# EAGLE design Terrarium (EAGLE 9.6.2)
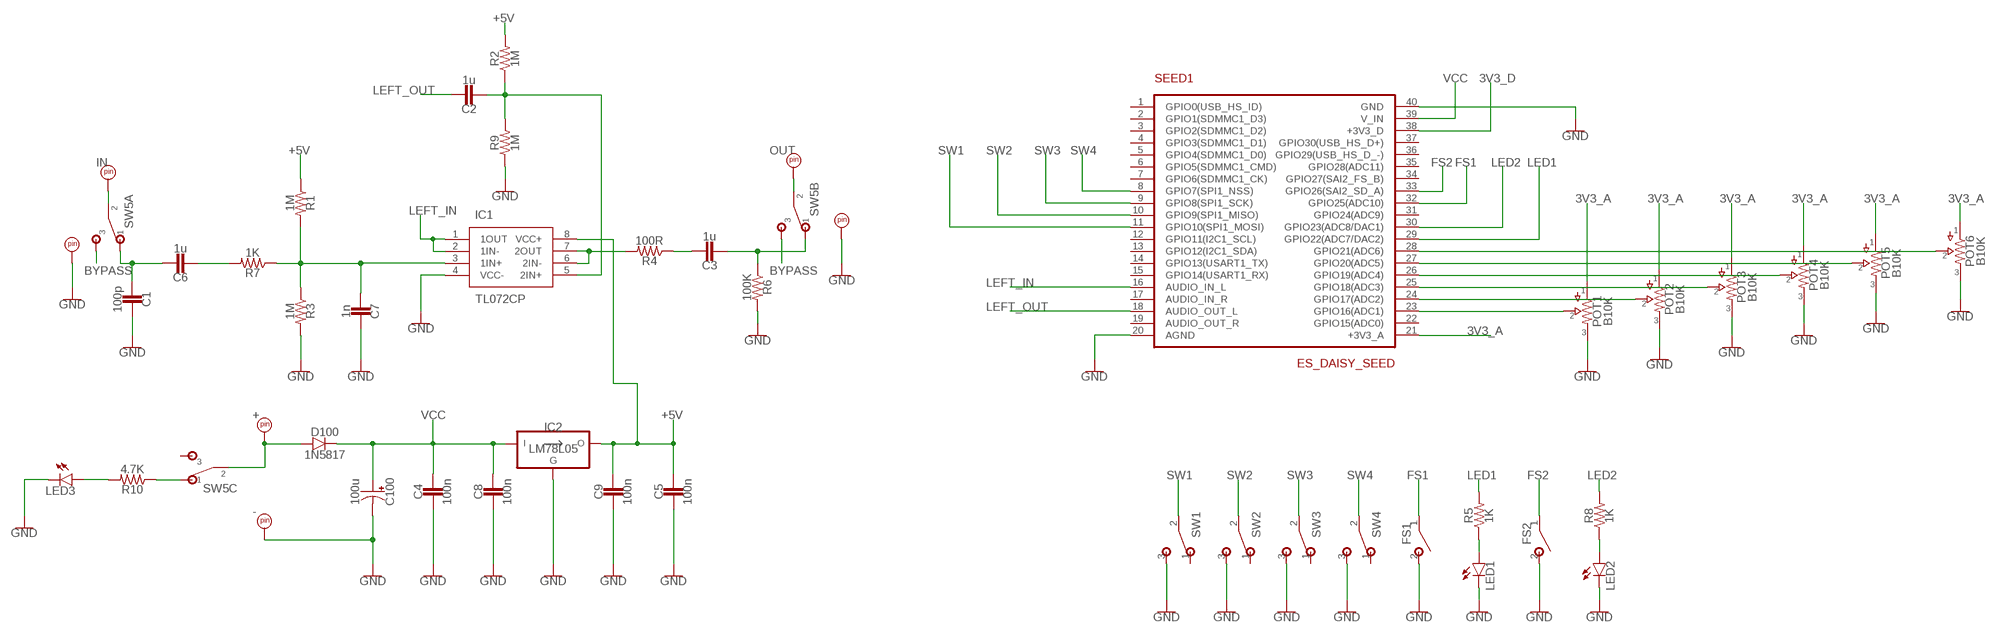
[diagram p0: schematic, sheet 1]

## Parts
C1  100p  CAP.2  [5MM]
C2  1u  CAP.5  [.33UF+]
C3  1u  CAP.5  [.33UF+]
C4  100n  CAP.2  [5MM]
C5  100n  CAP.2  [5MM]
C6  1u  CAP.5  [.33UF+]
C7  1n  CAP.2  [5MM]
C8  100n  CAP.2  [5MM]
C9  100n  CAP.2  [5MM]
C100  100u  5.0_MM.4  [050_2.5MM.2]
D100  1N5817  DO41.3  [DO41-3]
FS1  SPST  [SPST]
FS2  SPST  [SPST]
GND  PADRD  [UNLABELED]
IC1  TL072CP  [DIP794W53P254L959H508Q8N]
IC2  LM78L05  [TO92-]
IN  PADRD  [UNLABELED]
IN_GND  PADRD  [UNLABELED]
LED1  LED.3  [3MM_2]
LED2  LED.3  [3MM_2]
LED3  LED.3  [3MM_2]
OUT  PADRD  [UNLABELED]
OUT_GND  PADRD  [UNLABELED]
POT1  B10K  16MM.5  [16MM_PADS.2]
POT2  B10K  16MM.5  [16MM_PADS.2]
POT3  B10K  16MM.5  [16MM_PADS.2]
POT4  B10K  16MM.5  [16MM_PADS.2]
POT5  B10K  16MM.5  [16MM_PADS.2]
POT6  B10K  16MM.5  [16MM_PADS.2]
PWR  PADRD  [UNLABELED]
R1  1M  R.3B  [7.5MM.2]
R2  1M  R.3B  [7.5MM.2]
R3  1M  R.3B  [7.5MM.2]
R4  100R  R.3B  [7.5MM.2]
R5  1K  R.3B  [7.5MM.2]
R6  100K  R.3B  [7.5MM.2]
R7  1K  R.3B  [7.5MM.2]
R8  1K  R.3B  [7.5MM.2]
R9  1M  R.3B  [7.5MM.2]
R10  4.7K  R.3B  [7.5MM.2]
SEED1  ES_DAISY_SEED  [ES_DAISY_SEED]
SW1  SPDT.1  [SPDT_SOLDER_LUG]
SW2  SPDT.1  [SPDT_SOLDER_LUG]
SW3  SPDT.1  [SPDT_SOLDER_LUG]
SW4  SPDT.1  [SPDT_SOLDER_LUG]
SW5  3PDTTOGGLE  [3PDT2]

## Nets
3V3_A: POT1.1 POT2.1 POT3.1 POT4.1 POT5.1 POT6.1 SEED1.21(+3V3_A)
3V3_D: SEED1.38(+3V3_D)
+5V: C5.1 C9.1 IC1.8(VCC+) IC2.3(VO) R1.1 R2.2
BYPASS: SW5.A3 SW5.B3
FS1: FS1.1(P) SEED1.32(GPIO25(ADC10))
FS2: FS2.1(P) SEED1.33(GPIO26(SAI2_SD_A))
GND: C1.1 C4.2 C5.2 C7.1 C8.2 C9.2 C100.- FS1.2(S) FS2.2(S) GND.P$1 IC1.4(VCC-) IC2.2(GND) IN_GND.P$1 LED1.P$1(C) LED2.P$1(C) LED3.P$1(C) OUT_GND.P$1 POT1.3 POT2.3 POT3.3 POT4.3 POT5.3 POT6.3 R3.2 R6.2 R9.1 SEED1.20(AGND) SEED1.40(GND) SW1.3(S) SW2.3(S) SW3.3(S) SW4.3(S)
LED1: R5.2 SEED1.29(GPIO22(ADC7/DAC2))
LED2: R8.2 SEED1.30(GPIO23(ADC8/DAC1))
LEFT_IN: IC1.1(1OUT) IC1.2(1IN-) SEED1.16(AUDIO_IN_L)
LEFT_OUT: C2.1 SEED1.18(AUDIO_OUT_L)
N$1: POT1.2 SEED1.23(GPIO16(ADC1))
N$2: POT2.2 SEED1.24(GPIO17(ADC2))
N$3: POT3.2 SEED1.25(GPIO18(ADC3))
N$4: POT4.2 SEED1.26(GPIO19(ADC4))
N$5: POT5.2 SEED1.27(GPIO20(ADC5))
N$6: POT6.2 SEED1.28(GPIO21(ADC6))
N$7: LED1.ANODE(A) R5.1
N$8: LED2.ANODE(A) R8.1
N$9: D100.A PWR.P$1 SW5.C2
N$10: C3.1 R4.1
N$11: C3.2 R6.1 SW5.B1
N$12: C1.2 C6.1 SW5.A1
N$13: IN.P$1 SW5.A2
N$14: IC1.6(2IN-) IC1.7(2OUT) R4.2
N$15: C6.2 R7.2
N$16: C7.2 IC1.3(1IN+) R1.2 R3.1 R7.1
N$17: C2.2 IC1.5(2IN+) R2.1 R9.2
N$19: R10.1 SW5.C1
N$20: LED3.ANODE(A) R10.2
N$21: OUT.P$1 SW5.B2
SW1: SEED1.11(GPIO10(SPI1_MOSI)) SW1.2(P)
SW2: SEED1.10(GPIO9(SPI1_MISO)) SW2.2(P)
SW3: SEED1.9(GPIO8(SPI1_SCK)) SW3.2(P)
SW4: SEED1.8(GPIO7(SPI1_NSS)) SW4.2(P)
VCC: C4.1 C8.1 C100.+ D100.C IC2.1(VI) SEED1.39(V_IN)
Unconnected: SEED1.1(GPIO0(USB_HS_ID)) SEED1.2(GPIO1(SDMMC1_D3)) SEED1.3(GPIO2(SDMMC1_D2)) SEED1.4(GPIO3(SDMMC1_D1)) SEED1.5(GPIO4(SDMMC1_D0)) SEED1.6(GPIO5(SDMMC1_CMD)) SEED1.7(GPIO6(SDMMC1_CK)) SEED1.12(GPIO11(I2C1_SCL)) SEED1.13(GPIO12(I2C1_SDA)) SEED1.14(GPIO13(USART1_TX)) SEED1.15(GPIO14(USART1_RX)) SEED1.17(AUDIO_IN_R) SEED1.19(AUDIO_OUT_R) SEED1.22(GPIO15(ADC0)) SEED1.31(GPIO24(ADC9)) SEED1.34(GPIO27(SAI2_FS_B)) SEED1.35(GPIO28(ADC11)) SEED1.36(GPIO29(USB_HS_D_-)) SEED1.37(GPIO30(USB_HS_D+)) SW1.1(O) SW2.1(O) SW3.1(O) SW4.1(O) SW5.C3

## Library data of the parts
C1-C9 = capacitors-film:CAP: For Ceramic, Film, MLCC caps
C100 = capacitors-elec:5.0_MM: 5mm Diameter
D100 = diodes:DO41: DO-41 Package Diodes: 1N4001 - 1N40019 Zener Diodes: 1N4728 - 1N4764
FS1 FS2 = switches:SPST: For wired switch connections
GND = supply pins:PAD; NM: -
IC1 = SamacSys_Parts:TL072CP: Dual Low-Noise JFET-Input General-Purpose Operational Amplifier Source: Datasheet <http://www.ti.com/lit/ds/symlink/tl071a.pdf>; DESCRIPTION: Dual Low-Noise JFET-Input General-Purpose Operational Amplifier; HEIGHT: 5.08mm; MANUFACTURER_NAME: Texas Instruments; MANUFACTURER_PART_NUMBER: TL072CP; MOUSER_PART_NUMBER: 595-TL072CP; MOUSER_PRICE-STOCK: https://www.mouser.co.uk/ProductDetail/Texas-Instruments/TL072CP?qs=5nGYs9Do7G3e6Tx9uHIgUA%3D%3D
IC2 = regulators:LM78L05
IN = supply pins:PAD; NM: IN
IN_GND OUT_GND = supply pins:PAD; NM: GND
LED1-LED3 = diodes:LED
OUT = supply pins:PAD; NM: OUT
POT1-POT6 = potentiometers:16MM: 16mm Poteniometers
PWR = supply pins:PAD; NM: +
R1-R10 = resistors:R: 1/8W, 1/4W and 1W resistors
SEED1 = Electrosmith_Boards:ES_DAISY_SEED; IPN: Daisy Seed
SW1-SW4 = switches:SPDT: SPDT Toggle Switches
SW5 = switches:3PDT

## Board
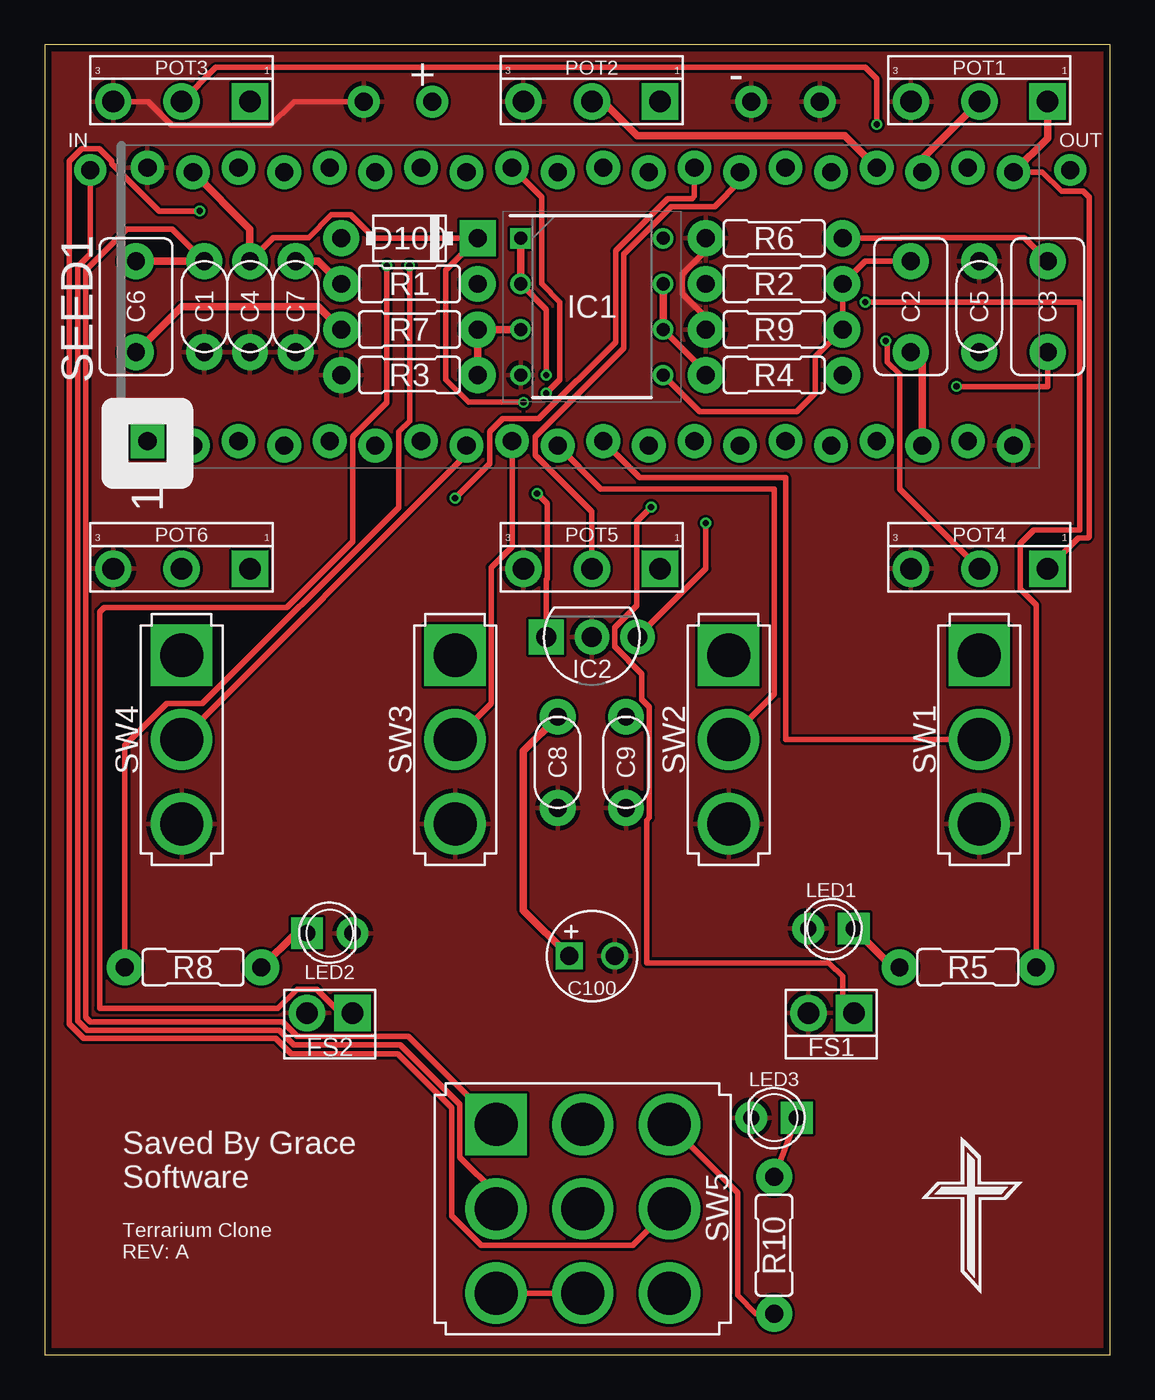
[diagram p1: board, top side]
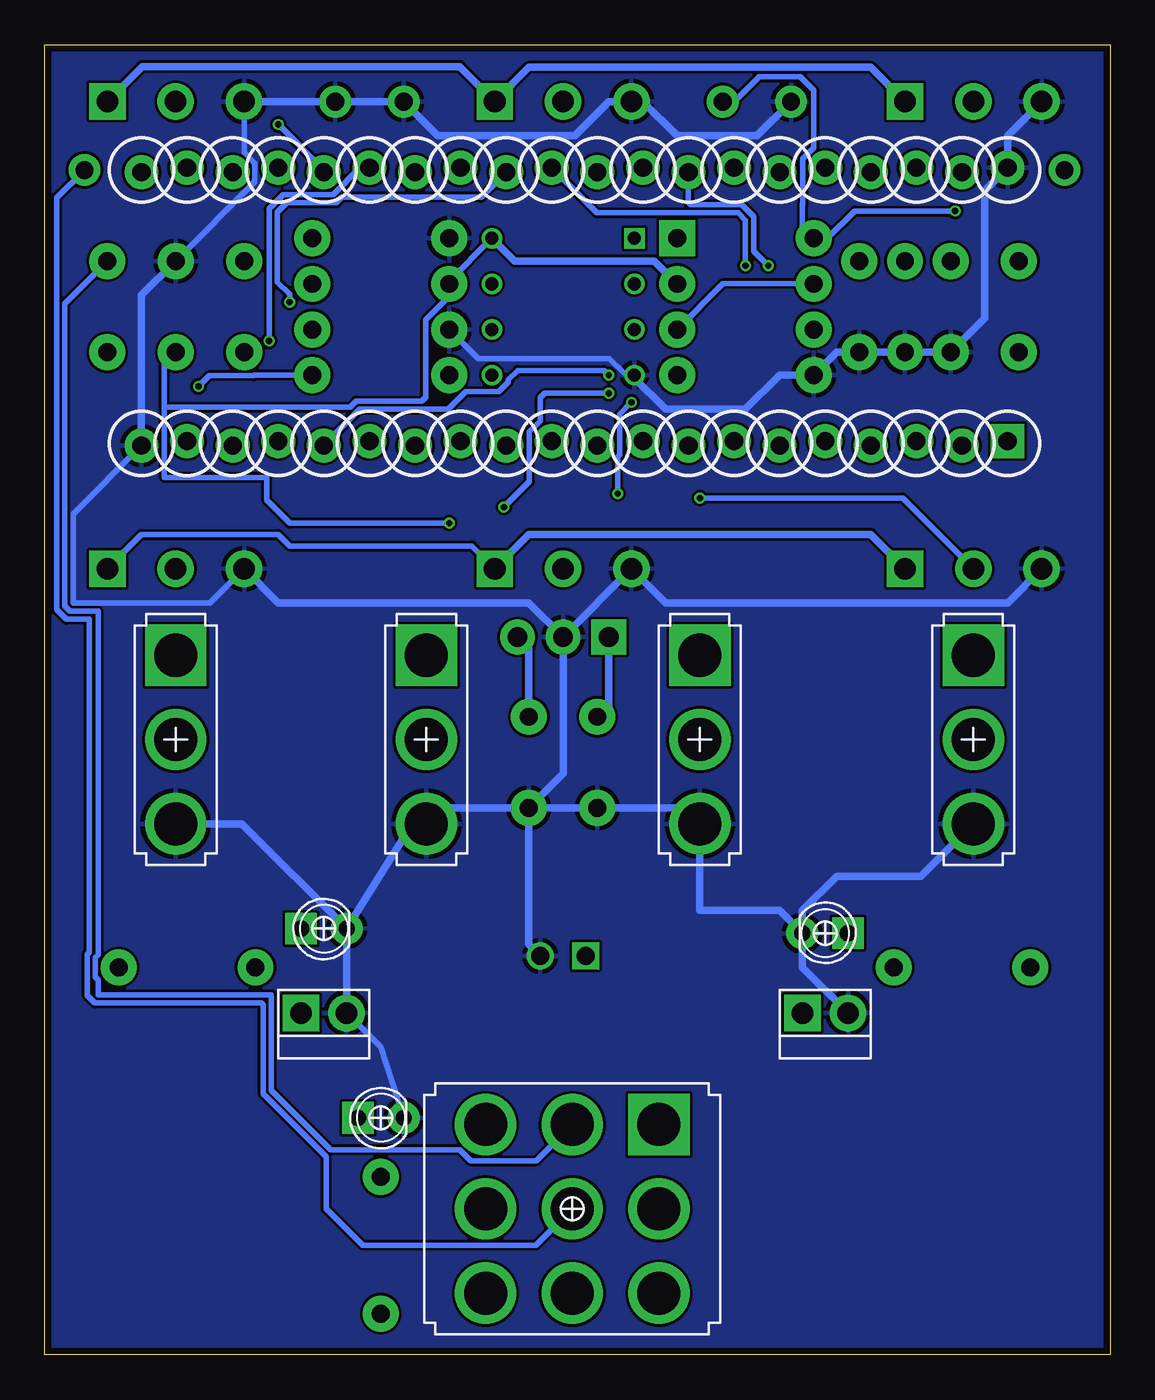
[diagram p2: board, bottom side, seen from below]

Size 59.36 x 73.02 mm. Coordinates in mm from the lower left corner, seen from the top.
Outline: 0,0 59.36,0 59.36,73.02 0,73.02 0,0
Copper layers (1*16): Top 0.035559375mm / dielectric 1.6mm / Bottom 0.035559375mm
Design rules "oshpark-2layer": minimum track width 6mil, minimum drill 10mil, track to track 6mil, track to pad 6mil, pad to pad 6mil, via to via 6mil, smd to smd 6mil, copper to edge 15mil, drill to drill 6mil, minimum pad ring 5mil, minimum via ring 5mil, stop-mask expansion 2.5mil, vias tented up to drill 0mil, thermal gap 10mil

### Footprints (pad centres in the part's own frame; a part is rotated, then mirrored left to right if it is on the bottom)
5MM = drill 1 pad 2: 1 -2.54,0; 2 2.54,0
.33UF+ = drill 1 pad 2: 1 -2.54,0; 2 2.54,0
050_2.5MM.2 = drill 1 square: + -1.27,0 | drill 1: - 1.27,0
DO41-3 = drill 1 pad 2: A 3.81,0 | drill 1 pad 2 square: C -3.81,0
SPST = drill 1.2 pad 2.032 square: 1 -1.27,0 | drill 1.2 pad 2.032: 2 1.27,0
UNLABELED = drill 1 pad 1.778: P$1 0,0
DIP794W53P254L959H508Q8N = drill 0.73 pad 1.13 square: 1 -3.97,3.81 | drill 0.73 pad 1.13: 2 -3.97,1.27; 3 -3.97,-1.27; 4 -3.97,-3.81; 5 3.97,-3.81; 6 3.97,-1.27; 7 3.97,1.27; 8 3.97,3.81
TO92- = drill 1.1 pad 1.93 square: 1 -2.54,0 | drill 1.1 pad 1.93: 2 0,0; 3 2.54,0
3MM_2 = drill 0.9 pad 1.778 square: ANODE -1.27,0 | drill 0.9 pad 1.778: P$1 1.27,0
16MM_PADS.2 = drill 1.2 pad 2.032 square: 1 3.81,0 | drill 1.2 pad 2.032: 2 0,0; 3 -3.81,0
7.5MM.2 = drill 1 pad 2: 1 -3.81,0; 2 3.81,0
ES_DAISY_SEED = drill 1.016 pad 1.88 square: 1 -7.493,24.13 | drill 1.016 pad 1.88: 2 -7.747,21.59; 3 -7.493,19.05; 4 -7.747,16.51; 5 -7.493,13.97; 6 -7.747,11.43; 7 -7.493,8.89; 8 -7.747,6.35; 9 -7.493,3.81; 10 -7.747,1.27; 11 -7.493,-1.27; 12 -7.747,-3.81; 13 -7.493,-6.35; 14 -7.747,-8.89; 15 -7.493,-11.43; 16 -7.747,-13.97; 17 -7.493,-16.51; 18 -7.747,-19.05; 19 -7.493,-21.59; 20 -7.747,-24.13; 21 7.493,-24.13; 22 7.747,-21.59; 23 7.493,-19.05; 24 7.747,-16.51; 25 7.493,-13.97; 26 7.747,-11.43; 27 7.493,-8.89; 28 7.747,-6.35; 29 7.493,-3.81; 30 7.747,-1.27; 31 7.493,1.27; 32 7.747,3.81; 33 7.493,6.35; 34 7.747,8.89; 35 7.493,11.43; 36 7.747,13.97; 37 7.493,16.51; 38 7.747,19.05; 39 7.493,21.59; 40 7.747,24.13
SPDT_SOLDER_LUG = drill 2.4 square: 1 4.699,0 | drill 2.4: 2 0,0; 3 -4.699,0
3PDT2 = drill 2.4 square: A1 -4.83,4.7 | drill 2.4: A2 -4.83,0; A3 -4.83,-4.7; B1 0,4.7; B2 0,0; B3 0,-4.7; C1 4.83,4.7; C2 4.83,0; C3 4.83,-4.7

### Placement (x,y rotation side)
C1  8.89,58.42 90 top
C2  48.26,58.42 90 top
C3  55.88,58.42 90 top
C4  11.43,58.42 270 top
C5  52.07,58.42 90 top
C6  5.08,58.42 270 top
C7  13.97,58.42 90 top
C8  28.57,33.02 270 top
C9  32.38,33.02 270 top
C100  30.48,22.23 0 top
D100  20.32,62.23 180 top
FS1  43.81,19.05 180 top
FS2  15.88,19.05 180 top
GND  39.37,69.85 0 top
IC1  30.48,58.42 0 top
IC2  30.48,40.01 0 top
IN  2.54,66.04 0 top
IN_GND  17.78,69.85 0 top
LED1  43.81,23.75 180 top
LED2  15.88,23.5 0 top
LED3  40.64,13.21 180 top
OUT  57.15,66.04 0 top
OUT_GND  43.18,69.85 0 top
POT1  52.07,69.85 0 top
POT2  30.48,69.85 0 top
POT3  7.62,69.85 0 top
POT4  52.07,43.81 0 top
POT5  30.48,43.81 0 top
POT6  7.62,43.81 0 top
PWR  21.59,69.85 0 top
R1  20.32,59.69 180 top
R2  40.64,59.69 180 top
R3  20.32,54.61 180 top
R4  40.64,54.61 180 top
R5  51.44,21.59 0 top
R6  40.64,62.23 180 top
R7  20.32,57.15 180 top
R8  8.26,21.59 180 top
R9  40.64,57.15 0 top
R10  40.64,6.1 90 top
SEED1  29.84,58.42 90 top
SW1  52.07,34.29 90 top
SW2  38.1,34.29 90 top
SW3  22.86,34.29 90 top
SW4  7.62,34.29 90 top
SW5  29.97,8.13 0 top

### Tracks (layer width: path | path; a pad name or v marks a point on that pad's centre or on a via)
3V3_A
  Top 0.305: POT4.1 57.58,45.52 58.1,45.52 58.19,45.61 58.19,64.52 57.86,64.85 56.66,64.85 55.59,65.91 SEED1.21
  Top 0.406: POT1.1 55.88,67.82 SEED1.21
  Bottom 0.305: POT5.1 35.56,45.09 45.72,45.09 46.35,45.72 53.98,45.72 POT4.1
  Bottom 0.406: POT6.1 13.34,45.72 32.38,45.72 POT5.1 | POT3.1 13.34,71.75 32.38,71.75 POT2.1 36.24,71.8 53.93,71.8 POT1.1
+5V  (via drill 0.35)
  Top 0.305: IC2.3 36.83,43.81 v36.83,46.35
  Bottom 0.305: v36.83,46.35 45.72,46.35 46.99,47.62 46.99,48.9 52.7,48.9 52.7,52.83 | 52.7,52.83 52.7,55.24 C5.1 | IC1.8 36.83,59.85 R2.2 36.83,58.99 38.13,57.69 38.13,53.38 38.35,53.16 42.02,53.16 42.35,52.83 52.7,52.83
  Bottom 0.406: C9.1 32.38,39.37 IC2.3 | R1.1 25.4,60.96 33.18,60.96 IC1.8
BYPASS
  Top 0.305: SW5.A3 SW5.B3
FS1  (via drill 0.35)
  Top 0.305: FS1.1 44.45,19.68 44.45,21.08 43.69,21.84 33.53,21.84 33.53,29.78 33.69,29.94 33.69,36.1 33.27,36.52 33.27,37.95 31.75,39.48 31.75,40.53 32.97,41.75 32.97,46.43 v33.78,47.24 | v27.94,53.59 28.7,54.36 28.7,58.67 27.69,59.69 27.69,64.52 SEED1.32
  Bottom 0.305: v33.78,47.24 32.36,48.67 32.36,51.44 31.75,52.05 31.75,53.34 31.5,53.59 v27.94,53.59
FS2  (via drill 0.35)
  Top 0.305: v19.05,60.71 19.05,53.07 17.17,51.19 17.17,45.34 13.49,41.66 3.3,41.66 3.05,41.4 3.05,19.3 12.99,19.3 14.06,20.37 15.15,20.37 16.47,19.05 FS2.1
  Bottom 0.305: SEED1.33 23.5,64.24 23.37,64.11 20.54,64.11 19.86,63.44 19.86,61.52 v19.05,60.71
GND
  Top 0.305: R6.2 36.83,61.53 35.52,60.23 35.52,59.15 36.83,57.84 R9.1 | IN_GND.P$1 13.89,69.85 12.57,68.53 7.07,68.53 5.75,69.85 POT3.3
  Bottom 0.305: POT4.3 50.16,41.91 57.78,41.91 57.78,46.86 SEED1.20 | R9.1 35.21,55.53 27.9,55.53 26.97,54.61 IC1.4 | POT1.3 48.26,67.04 47.65,66.43 47.65,65.38 C5.2 | LED3.P$1 40.64,17.14 FS1.2
  Bottom 0.406: FS2.2 17.14,21.59 LED2.P$1 | SW4.3 10.54,26.67 15.24,26.67 17.14,24.77 LED2.P$1 | LED2.P$1 18.41,24.77 22.86,24.77 SW3.3 23.75,30.48 C8.2 C9.2 | C9.2 32.38,22.86 C100.- | C9.2 37.21,30.48 SW2.3 38.89,29.59 LED1.P$1 | FS1.2 LED1.P$1 | C9.2 30.48,32.38 IC2.2 | IC2.2 POT5.3 24.77,41.91 5.71,41.91 POT6.3 | IC2.2 32.38,41.91 46.35,41.91 POT4.3 | POT1.3 OUT_GND.P$1 GND.P$1 37.47,67.94 29.84,67.94 27.94,69.85 POT2.3 26.04,69.85 24.13,67.94 19.68,67.94 IN_GND.P$1 | POT3.3 5.71,67.94 SEED1.40 6.99,64.9 6.99,57.78 C1.1 C4.2 C7.1 15.24,55.88 R3.2 18.41,54.61 20.32,52.7 24.77,52.7 26.51,54.45 IC1.4 | C5.2 53.98,59.05 SEED1.20 | LED1.P$1 48.39,29.59 SW1.3
  pour Top: 0,72.9 0,0.25 0.25,0 59.18,0 59.44,0.25 59.44,72.9
  pour Bottom: 0,72.9 0,0 59.44,0 59.44,72.9
LED1  (via drill 0.35)
  Top 0.305: R5.2 55.24,41.78 54.36,42.67 54.36,45.21 55.12,45.97 57.66,45.97 57.66,58.67 v45.72,58.67
  Bottom 0.305: SEED1.29 35.05,64.52 42.8,64.52 43.11,64.21 45.89,64.21 46.41,63.69 46.41,59.8 45.72,59.12 v45.72,58.67
LED2  (via drill 0.35)
  Top 0.305: v20.32,60.71 20.32,52.05 19.71,51.44 19.71,47.23 8.78,36.3 6.79,36.3 4.45,33.96 R8.2
  Bottom 0.305: SEED1.30 28.6,63.65 20.73,63.65 20.32,63.25 v20.32,60.71
LEFT_IN  (via drill 0.35)
  Top 0.305: IC1.2 27.94,58.26 v27.94,54.61
  Top 0.406: IC1.1 IC1.2
  Bottom 0.305: SEED1.16 43.81,50.72 41.83,52.7 36.89,52.7 35.91,53.69 34.07,53.69 33.53,54.23 33.53,54.36 33.02,54.86 28.19,54.86 v27.94,54.61
LEFT_OUT
  Top 0.406: C2.1 48.9,55.24 SEED1.18
N$1
  Top 0.406: POT1.2 48.9,66.67 SEED1.23
N$2
  Top 0.406: POT2.2 31.11,69.85 33.02,67.94 44.58,67.94 SEED1.24
N$3  (via drill 0.35)
  Top 0.305: POT3.2 9.53,71.75 45.72,71.75 46.35,71.12 v46.35,68.58
  Bottom 0.305: v46.35,68.58 43.81,66.04 SEED1.25
N$4  (via drill 0.35)
  Top 0.305: POT4.2 47.62,48.26 47.62,54.67 46.95,55.34 46.95,56.42 v46.86,56.52
  Bottom 0.305: v46.86,56.52 46.86,63.88 46.08,64.67 43.3,64.67 41.8,66.17 SEED1.26
N$5
  Top 0.305: POT5.2 30.48,47.01 27.33,50.16 27.33,51.19 32.26,56.12 32.26,61.34 34.91,63.99 37.32,63.99 38.73,65.41 SEED1.27
N$6  (via drill 0.35)
  Top 0.305: SEED1.28 36.2,64.58 36.07,64.45 34.72,64.45 31.8,61.53 31.8,56.44 27.53,52.17 25.52,52.17 24.79,51.44 24.79,49.68 v22.86,47.75
  Bottom 0.305: v22.86,47.75 11.56,47.75 POT6.2
N$7
  Top 0.406: LED1.ANODE 47.24,21.59 R5.1
N$8
  Top 0.406: R8.1 13.97,23.5 LED2.ANODE
N$9  (via drill 0.35)
  Top 0.305: v8.64,63.75 6.37,63.75 3.73,66.39 3.73,66.53 3.03,67.23 2.05,67.23 1.35,66.53 1.35,18.44 2.16,17.63 12.85,17.63 13.72,16.76 19.67,16.76 22.67,13.77 22.67,7.75 24.33,6.1 32.77,6.1 SW5.C2
  Bottom 0.305: PWR.P$1 20.95,69.85 19.56,71.25 17.27,71.25 16.51,70.48 16.51,67.29 17.12,66.68 17.12,64.16 17.14,64.14 17.14,62.87 D100.A 15.75,62.23 14.22,63.75 v8.64,63.75
N$10  (via drill 0.35)
  Top 0.305: v50.8,53.98 55.88,53.98 C3.1
  Bottom 0.305: R4.1 47.69,54.61 47.72,54.58 50.2,54.58 v50.8,53.98
N$11
  Top 0.305: R6.1 47.69,62.23 47.72,62.27 54.58,62.27 C3.2
  Bottom 0.305: C3.2 58.24,58.6 58.24,41.72 57.97,41.45 56.39,41.45 56.39,22.29 56.55,22.13 56.55,21.05 56.39,20.89 56.39,20.07 46.74,20.07 46.74,14.73 43.43,11.43 36.25,11.43 35.64,10.81 31.98,10.81 SW5.B1
N$12
  Top 0.305: C1.2 7.11,62.74 4.57,62.74 2.29,60.45 2.29,18.8 2.54,18.54 13.24,18.54 14.06,17.73 20.24,17.73 SW5.A1
  Top 0.406: C6.1 C1.2
N$13
  Top 0.305: IN.P$1 2.54,61.35 1.83,60.64 1.83,18.61 2.35,18.09 13.06,18.09 13.87,17.27 19.81,17.27 23.13,13.96 23.13,10.99 25.14,8.98 SW5.A2
N$14
  Top 0.305: IC1.6 36.83,54.77 R4.2
  Top 0.406: IC1.7 IC1.6
N$15
  Top 0.406: C6.2 7.62,58.42 15.24,58.42 R7.2
N$16
  Top 0.406: C7.2 15.24,60.96 R1.2 | IC1.3 R7.1 R3.1
  Bottom 0.305: R1.2 21.59,59.69 R7.1
N$17
  Top 0.305: C2.2 45.72,60.96 R2.1 R9.2 42.93,55.63 42.93,53.59 41.91,52.58 36.48,52.58 IC1.5
N$19
  Top 0.305: SW5.C1 38.61,9.02 38.61,3.3 39.62,2.29 R10.1
N$20
  Top 0.305: R10.2 LED3.ANODE
N$21
  Bottom 0.305: SW5.B2 32,6.1 41.66,6.1 43.69,8.13 43.69,11.04 47.19,14.54 47.19,19.51 47.3,19.61 56.58,19.61 57.01,20.04 57.01,22.32 56.9,22.43 56.9,41 58.16,41 58.7,41.53 58.7,64.49 OUT.P$1
SW1
  Top 0.305: SEED1.11 33.15,48.9 41.27,48.9 41.27,34.29 SW1.2
SW2
  Top 0.305: SEED1.10 30.99,48.26 40.64,48.26 40.64,36.83 SW2.2
SW3
  Top 0.305: SEED1.9 26.04,45.05 24.87,43.89 24.87,36.3 SW3.2
SW4
  Top 0.305: SW4.2 23.5,50.16 SEED1.8
VCC  (via drill 0.35)
  Top 0.305: IC2.1 27.94,43.22 27.99,43.27 27.99,47.45 v27.43,48.01 | v26.67,53.09 23.62,53.09 22.35,54.36 22.35,60.45 D100.C 18.36,62.23 17.05,63.53 15.97,63.53 14.7,62.27 12.73,62.27 C4.1
  Top 0.406: C100.+ 26.67,24.77 26.67,33.66 C8.1 | SEED1.39 11.43,62.74 C4.1
  Bottom 0.305: v27.43,48.01 27.43,50.06 27.33,50.16 27.33,52.43 v26.67,53.09
  Bottom 0.406: C8.1 27.94,36.2 IC2.1

### Text on the board
tNames: Saved By Grace / Software | Terrarium Clone / REV: A